# Altium schematic sheet PCIe_MUX.SchDoc: MirkoPC (2024)
size 304 x 203 mm; Engineer: M. Folejewski; DocumentNumber: 1; SheetNumber: 1; SheetTotal: 1; PageSize: N/A; Designators: 1xx
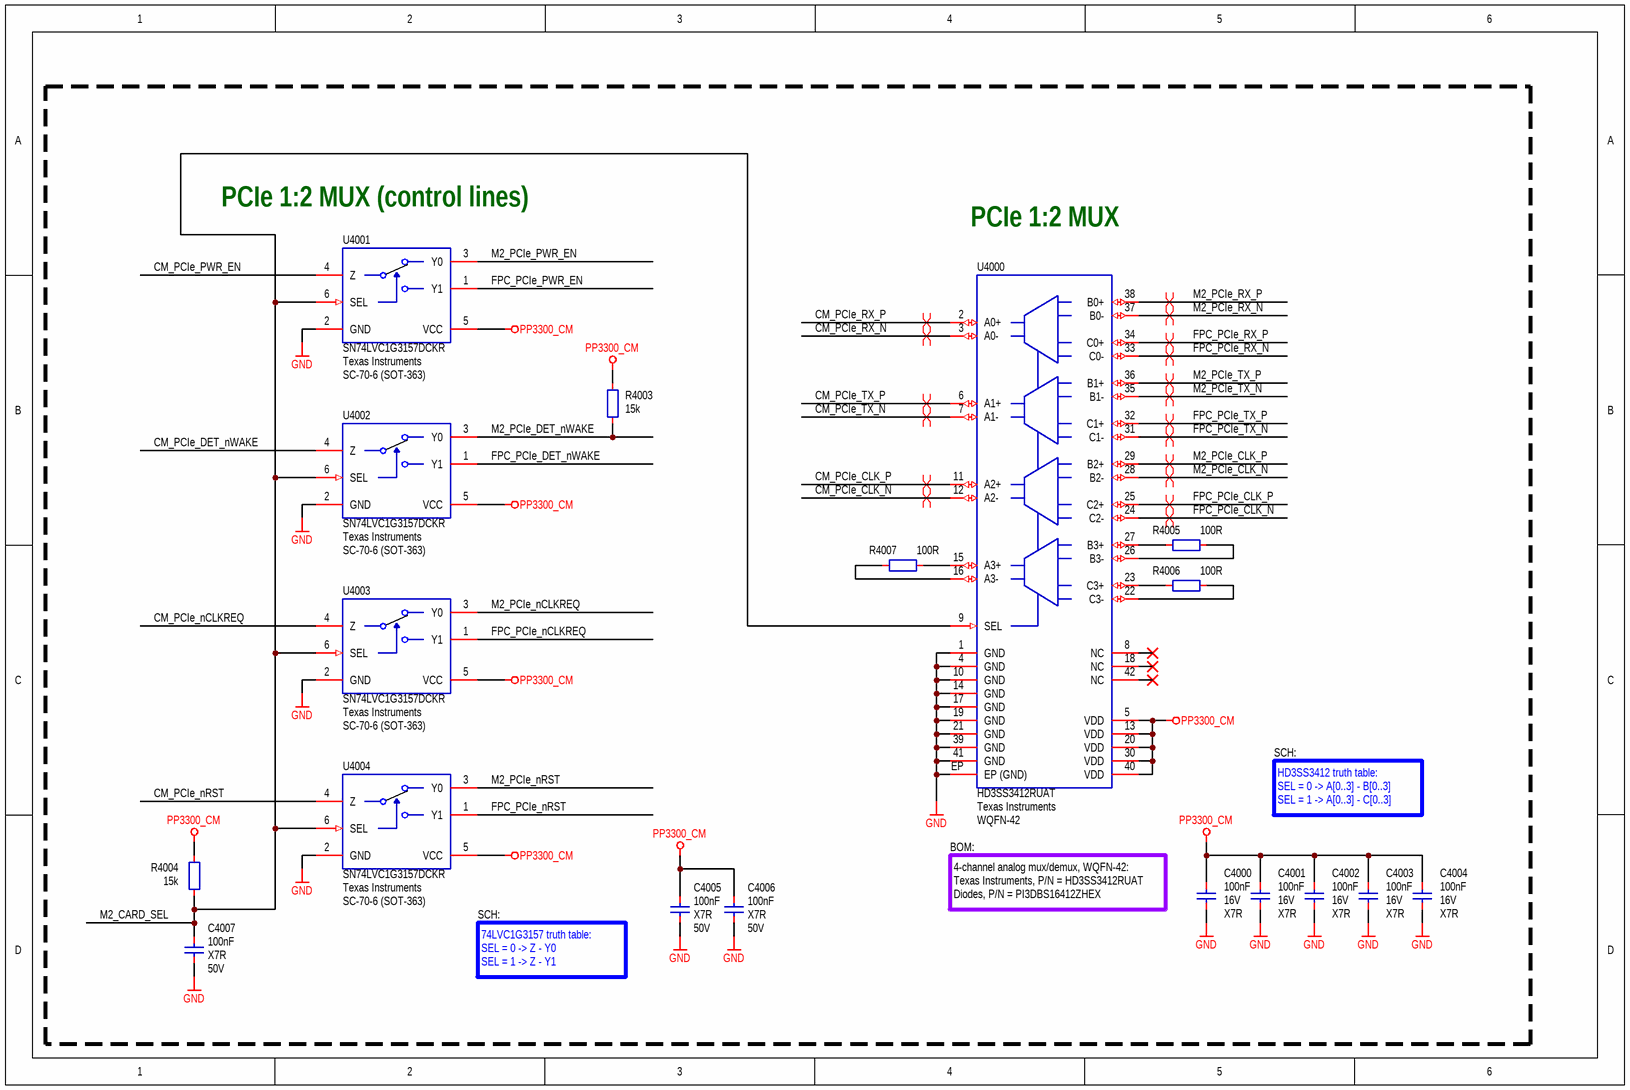
[diagram p0: PCIe_MUX.SchDoc]

## Parts
C4000  100nF  Voltage Rating: 16V  Dielectric: X7R  [CAP_0402_R]
C4001  100nF  Voltage Rating: 16V  Dielectric: X7R  [CAP_0402_R]
C4002  100nF  Voltage Rating: 16V  Dielectric: X7R  [CAP_0402_R]
C4003  100nF  Voltage Rating: 16V  Dielectric: X7R  [CAP_0402_R]
C4004  100nF  Voltage Rating: 16V  Dielectric: X7R  [CAP_0402_R]
C4005  100nF  Voltage Rating: 50V  Dielectric: X7R  [CAP_0603_R]
C4006  100nF  Voltage Rating: 50V  Dielectric: X7R  [CAP_0603_R]
C4007  100nF  Voltage Rating: 50V  Dielectric: X7R  [CAP_0603_R]
R4003  15k  [RES_0603_R]
R4004  15k  [RES_0603_R]
R4005  100R  [RES_0402_R]
R4006  100R  [RES_0402_R]
R4007  100R  [RES_0402_R]
U4000  Manufacturer: Texas Instruments  MPN: HD3SS3412RUAT  Package (Case): WQFN-42  [ICC_WQFN42_900X350H80_P50_EP]  (hidden comment: HD3SS3412)
U4001  Manufacturer: Texas Instruments  MPN: SN74LVC1G3157DCKR  Package (Case): SC-70-6 (SOT-363)  [ICC_SOT363_SC70-6_TSSOP6_P65_R]  (hidden comment: 74LVC1G3157)
U4002  Manufacturer: Texas Instruments  MPN: SN74LVC1G3157DCKR  Package (Case): SC-70-6 (SOT-363)  [ICC_SOT363_SC70-6_TSSOP6_P65_R]  (hidden comment: 74LVC1G3157)
U4003  Manufacturer: Texas Instruments  MPN: SN74LVC1G3157DCKR  Package (Case): SC-70-6 (SOT-363)  [ICC_SOT363_SC70-6_TSSOP6_P65_R]  (hidden comment: 74LVC1G3157)
U4004  Manufacturer: Texas Instruments  MPN: SN74LVC1G3157DCKR  Package (Case): SC-70-6 (SOT-363)  [ICC_SOT363_SC70-6_TSSOP6_P65_R]  (hidden comment: 74LVC1G3157)

## Nets
GND: C4000.1 C4001.1 C4002.1 C4003.1 C4004.1 C4005.1 C4006.1 C4007.1 U4000.1(GND) U4000.4(GND) U4000.10(GND) U4000.14(GND) U4000.17(GND) U4000.19(GND) U4000.21(GND) U4000.39(GND) U4000.41(GND) U4000.EP(EP_(GND)) U4001.2(GND) U4002.2(GND) U4003.2(GND) U4004.2(GND)
PP3300_CM: C4000.2 C4001.2 C4002.2 C4003.2 C4004.2 C4005.2 C4006.2 R4003.1 R4004.1 U4000.5(VDD) U4000.13(VDD) U4000.20(VDD) U4000.30(VDD) U4000.40(VDD) U4001.5(VCC) U4002.5(VCC) U4003.5(VCC) U4004.5(VCC)
CM_PCIe_CLK_N: U4000.12(A2-)
CM_PCIe_CLK_P: U4000.11(A2+)
CM_PCIe_DET_nWAKE: U4002.4(Z)
CM_PCIe_nCLKREQ: U4003.4(Z)
CM_PCIe_nRST: U4004.4(Z)
CM_PCIe_PWR_EN: U4001.4(Z)
CM_PCIe_RX_N: U4000.3(A0-)
CM_PCIe_RX_P: U4000.2(A0+)
CM_PCIe_TX_N: U4000.7(A1-)
CM_PCIe_TX_P: U4000.6(A1+)
FPC_PCIe_CLK_N: U4000.24(C2-)
FPC_PCIe_CLK_P: U4000.25(C2+)
FPC_PCIe_DET_nWAKE: U4002.1(Y1)
FPC_PCIe_nCLKREQ: U4003.1(Y1)
FPC_PCIe_nRST: U4004.1(Y1)
FPC_PCIe_PWR_EN: U4001.1(Y1)
FPC_PCIe_RX_N: U4000.33(C0-)
FPC_PCIe_RX_P: U4000.34(C0+)
FPC_PCIe_TX_N: U4000.31(C1-)
FPC_PCIe_TX_P: U4000.32(C1+)
M2_CARD_SEL: C4007.2 R4004.2 U4000.9(SEL) U4001.6(SEL) U4002.6(SEL) U4003.6(SEL) U4004.6(SEL)
M2_PCIe_CLK_N: U4000.28(B2-)
M2_PCIe_CLK_P: U4000.29(B2+)
M2_PCIe_DET_nWAKE: R4003.2 U4002.3(Y0)
M2_PCIe_nCLKREQ: U4003.3(Y0)
M2_PCIe_nRST: U4004.3(Y0)
M2_PCIe_PWR_EN: U4001.3(Y0)
M2_PCIe_RX_N: U4000.37(B0-)
M2_PCIe_RX_P: U4000.38(B0+)
M2_PCIe_TX_N: U4000.35(B1-)
M2_PCIe_TX_P: U4000.36(B1+)
NetR4005_1: R4005.1 U4000.26(B3-)
NetR4005_2: R4005.2 U4000.27(B3+)
NetR4006_1: R4006.1 U4000.22(C3-)
NetR4006_2: R4006.2 U4000.23(C3+)
NetR4007_1: R4007.1 U4000.15(A3+)
NetR4007_2: R4007.2 U4000.16(A3-)

Not connected (* = marked no-connect by the designer): U4000 8(NC)* 18(NC)* 42(NC)*

## Layout directives
differential pair: CM_PCIe_CLK_N, CM_PCIe_CLK_P, CM_PCIe_RX_N, CM_PCIe_RX_P, CM_PCIe_TX_N, CM_PCIe_TX_P, FPC_PCIe_CLK_N, FPC_PCIe_CLK_P, FPC_PCIe_RX_N, FPC_PCIe_RX_P, FPC_PCIe_TX_N, FPC_PCIe_TX_P, M2_PCIe_CLK_N, M2_PCIe_CLK_P, M2_PCIe_RX_N, M2_PCIe_RX_P, M2_PCIe_TX_N, M2_PCIe_TX_P

## Notes on the sheet
- (near U4001) PCIe 1:2 MUX (control lines)
- PCIe 1:2 MUX
- SCH:
- HD3SS3412 truth table:
  SEL = 0 -> A[0..3] - B[0..3]
  SEL = 1 -> A[0..3] - C[0..3]
- (near C4000) 4-channel analog mux/demux, WQFN-42:
  Texas Instruments, P/N = HD3SS3412RUAT
  Diodes, P/N = PI3DBS16412ZHEX
- BOM:
- 74LVC1G3157 truth table:
  SEL = 0 -> Z - Y0
  SEL = 1 -> Z - Y1

## Library data of the parts
C4000-C4004 = CAP-0004: Capacitor; MLCC; 100nF; 16VDC; X7R; 10%; Standard; SMD; 0402 (1005);; Manufacturer: Murata Manufacturing; MPN: GRM155R71C104KA88D; Component Body: 1.00 x 0.50mm; Packaging Type: Tape & Reel; ID: CAP-0004; Component Type: Capacitor; Component Subtype: MLCC; Value: 100nF; Mounting Type: SMD; Package (Case): 0402 (1005); Component Height: 0.50mm; ROHS Status: RoHS Compliant; Operating Temperature: -55°C to +125°C; Capacitance: 100nF; Tolerance: 10%; Features: Standard; Supplier 1: LCSC; Supplier 2: Mouser; Supplier 3: DigiKey; Supplier Part Number 1: C71629
C4005-C4007 = CAP-0008: Capacitor; MLCC; 100nF; TBD; TBD; TBD; TBD; SMD; 0603 (1608);; ID: CAP-0008; Component Type: Capacitor; Component Subtype: MLCC; Value: 100nF; Manufacturer: TBD; MPN: TBD; Mounting Type: SMD; Package (Case): 0603 (1608); Component Body: TBD; Component Height: TBD; Packaging Type: TBD; ROHS Status: TBD; Operating Temperature: TBD; Capacitance: 100nF; Tolerance: TBD; Features: TBD; Supplier 1: LCSC; Supplier 2: Mouser; Supplier 3: DigiKey; Supplier Part Number 1: C14663
R4003 R4004 = RES-0054: Resistor; Thick Film; GENERIC; TBD; TBD; TBD; TBD; TBD; SMD; 0603 (1608);; Manufacturer: Yageo Corporation; MPN: RC0603FR-0715KL; Component Body: 1.60 x 0.80mm; Tolerance: 1%; Power Rating: 100mW; ID: RES-0054; Component Type: Resistor; Component Subtype: Thick Film; Value: 15k; Mounting Type: SMD; Package (Case): 0603 (1608); Component Height: TBD; Packaging Type: TBD; ROHS Status: TBD; Operating Temperature: TBD; Resistance: 15k; TCR: TBD; Voltage Rating: TBD; Features: TBD; Supplier 1: LCSC; Supplier 2: Mouser; Supplier 3: DigiKey; Supplier Part Number 1: C114661
R4005-R4007 = RES-0003: Resistor; Thick Film; 1k; 1%; 62.5mW; 100PPM; 50V; Standard; SMD; 0402 (1005);; Manufacturer: Yageo Corporation; MPN: RC0402FR-07100RL; Component Body: 1.00 x 0.50mm; Packaging Type: Tape & Reel; ID: RES-0003; Component Type: Resistor; Component Subtype: Thick Film; Value: 100R; Mounting Type: SMD; Package (Case): 0402 (1005); Component Height: 0.35mm; ROHS Status: RoHS Compliant; Operating Temperature: -55°C to +155°C; Resistance: 100R; Tolerance: 1%; Power Rating: 62.5mW; TCR: 100PPM; Voltage Rating: 50V; Features: Standard; Supplier 1: LCSC; Supplier Part Number 1: C106232
U4000 = ICC_TXI_HD3SS3412_WQFN42: ICC; Analog Mux/Demux;; Component Subtype: Analog Mux/Demux; Component Type: IC; Mounting Type: SMD; Supplier 1: LCSC; Supplier 2: Mouser; Supplier 3: DigiKey; Supplier Part Number 1: C2876348; Value: HD3SS3412
U4001-U4004 = ICC_NXP_74LVC1G3157GW: ICC; Specification: SPDT analog switch, SOT363 package; Component Type: IC; Mounting Type: SMD; Operating Temperature: -40°C to +85°C; Value: 74LVC1G3157; Supplier 1: LCSC; Supplier 2: Mouser; Supplier Part Number 1: C38663